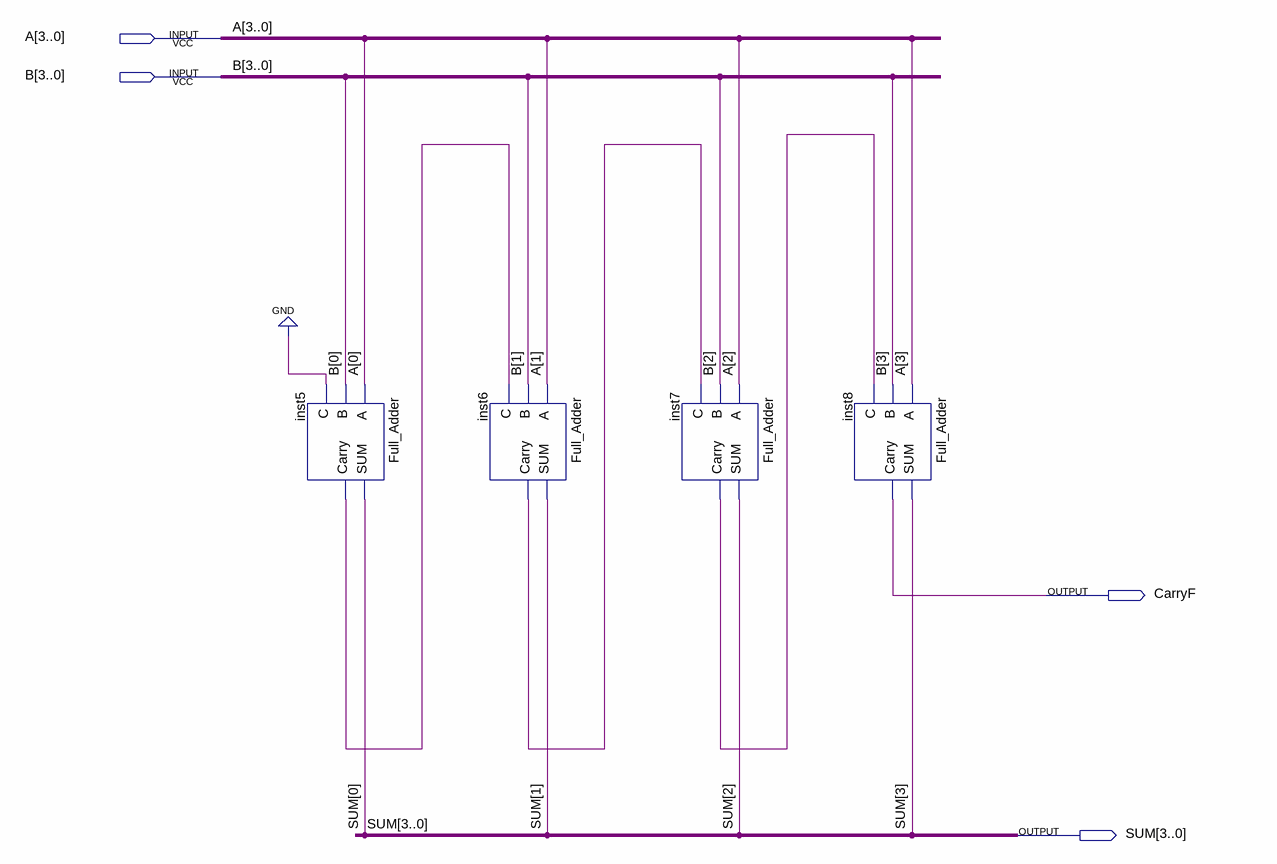
[diagram p0: schematic sheet]
// Quartus schematic Combination_Buses.bdf as structural Verilog: 4 symbols, 4 pins
module Combination_Buses (
  input  [3:0] A,
  input  [3:0] B,
  output CarryF,
  output [3:0] SUM
);

  wire inst5_carry, inst6_carry, inst7_carry;

  Full_Adder inst5 (.A(A[0]), .B(B[0]), .C(1'b0), .SUM(SUM[0]), .Carry(inst5_carry));
  Full_Adder inst6 (.A(A[1]), .B(B[1]), .C(inst5_carry), .SUM(SUM[1]), .Carry(inst6_carry));
  Full_Adder inst7 (.A(A[2]), .B(B[2]), .C(inst6_carry), .SUM(SUM[2]), .Carry(inst7_carry));
  Full_Adder inst8 (.A(A[3]), .B(B[3]), .C(inst7_carry), .SUM(SUM[3]), .Carry(CarryF));
endmodule
